# Altium schematic sheet 09.SchDoc
size 297 x 209 mm
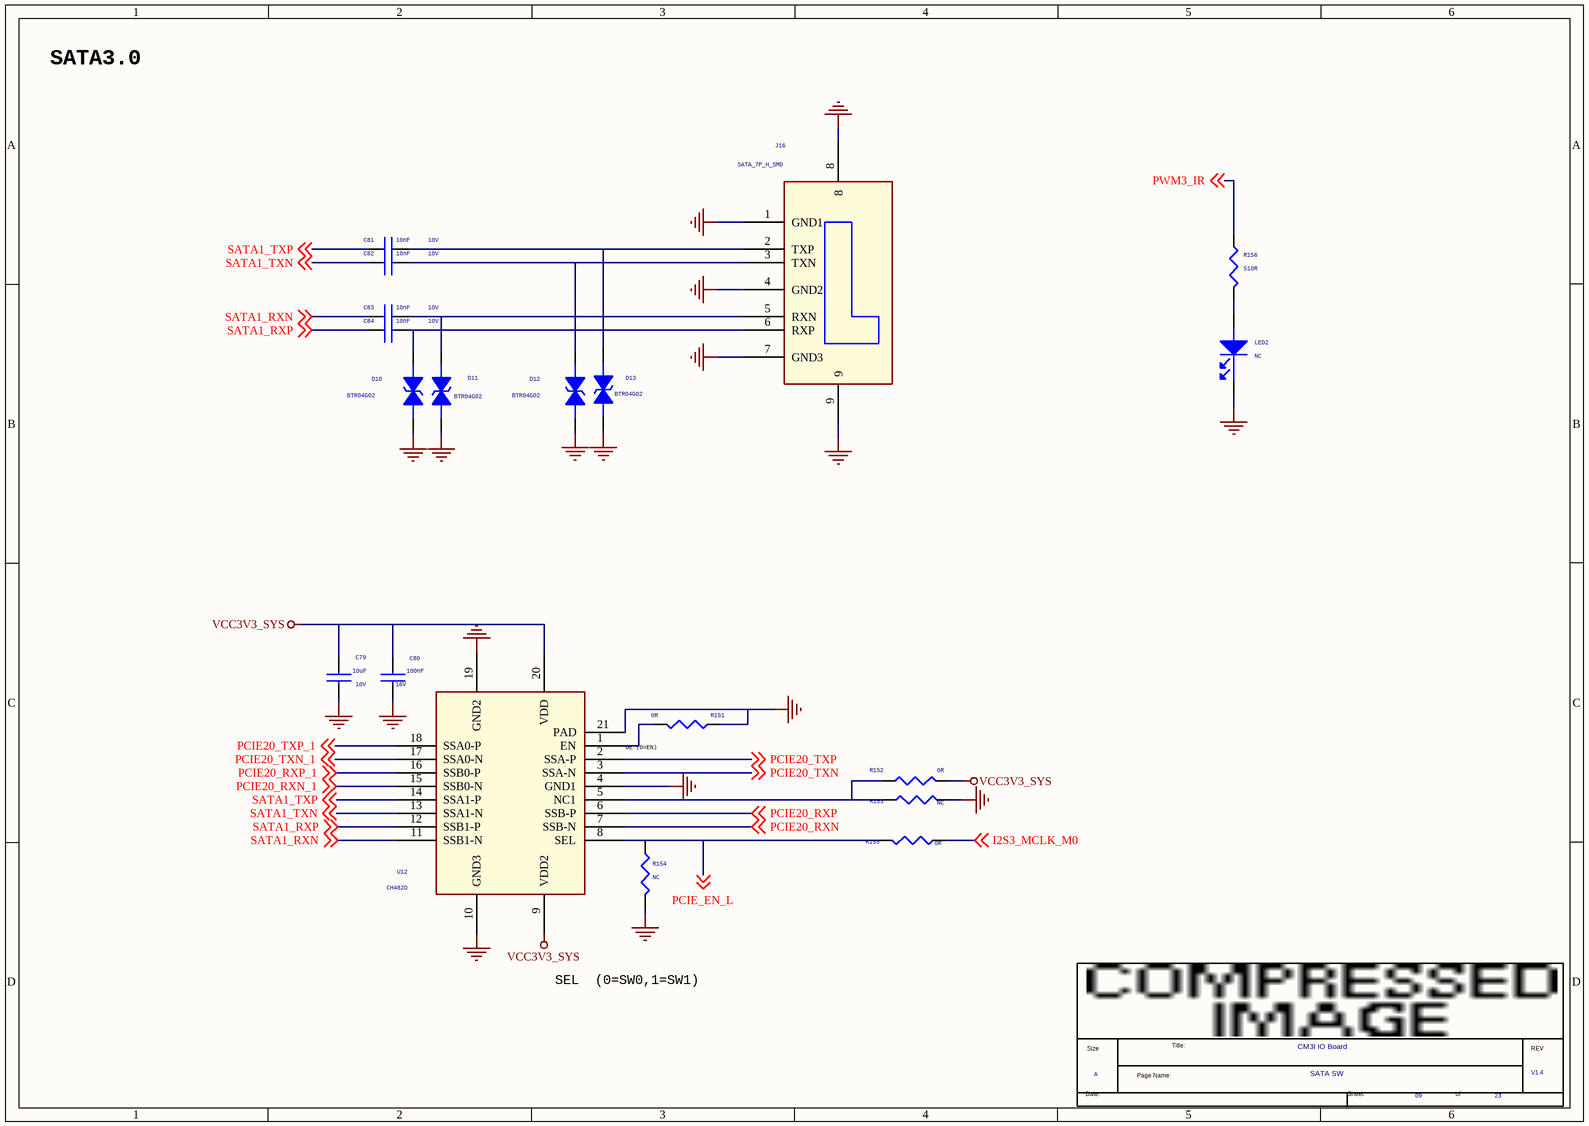
[diagram p0: 09.SchDoc]

## Parts
*  Page Count: 23  Page Number: 09  Page Size: A  Title: CM3I IO Board  RevCode: V1.4  Doc: SATA SW  (hidden comment: radxa_1010)  (graphical)
C79  10uF  Voltage: 10V  [C0603]
C80  100nF  Voltage: 16V  [C0402]
C81  10nF  Voltage: 10V  [C0402]
C82  10nF  Voltage: 10V  [C0402]
C83  10nF  Voltage: 10V  [C0402]
C84  10nF  Voltage: 10V  [C0402]
D10  BTR04G02  [ESD0402_1xD5]
D11  BTR04G02  [ESD0402_1xD5]
D12  BTR04G02  [ESD0402_1xD5]
D13  BTR04G02  [ESD0402_1xD5]
J16  SATA_7P_H_SMD  [SMD_SATA_7P_50_180]
LED2  NC  [LED0603]
R151  0R  [R0402]
R152  0R  [R0402]
R153  NC  [R0402]
R154  NC  [R0402]
R155  0R  [R0402]
R156  510R  [R0402]
U12  CH482D  [CH482X]

## Nets
GND: C79.2 C80.2 D10.1 D11.1 D12.1 D13.1 J16.1(GND1) J16.4(GND2) J16.7(GND3) J16.8 J16.9 LED2.2(CATHODE) R151.1 R153.1 R154.2 U12.4(GND1) U12.10(GND3) U12.19(GND2) U12.21(PAD)
VCC3V3_SYS: C79.1 C80.1 R152.1 U12.9(VDD2) U12.20(VDD)
I2S3_MCLK_M0: R155.2 ; off-sheet I2S3_MCLK_M0
PCIE20_RXN: U12.7(SSB-N) ; off-sheet PCIE20_RXN
PCIE20_RXN_1: U12.15(SSB0-N) ; off-sheet PCIE20_RXN_1
PCIE20_RXP: U12.6(SSB-P) ; off-sheet PCIE20_RXP
PCIE20_RXP_1: U12.16(SSB0-P) ; off-sheet PCIE20_RXP_1
PCIE20_TXN: U12.3(SSA-N) ; off-sheet PCIE20_TXN
PCIE20_TXN_1: U12.17(SSA0-N) ; off-sheet PCIE20_TXN_1
PCIE20_TXP: U12.2(SSA-P) ; off-sheet PCIE20_TXP
PCIE20_TXP_1: U12.18(SSA0-P) ; off-sheet PCIE20_TXP_1
PCIE_EN_L: R154.1 R155.1 U12.8(SEL) ; off-sheet PCIE_EN_L
PWM3_IR: R156.1 ; off-sheet PWM3_IR
SATA1_RXN: C83.1 U12.11(SSB1-N) ; off-sheet SATA1_RXN
SATA1_RXP: C84.1 U12.12(SSB1-P) ; off-sheet SATA1_RXP
SATA1_TXN: C82.1 U12.13(SSA1-N) ; off-sheet SATA1_TXN
SATA1_TXP: C81.1 U12.14(SSA1-P) ; off-sheet SATA1_TXP
NetC81_2: C81.2 D13.2 J16.2(TXP)
NetC82_2: C82.2 D12.2 J16.3(TXN)
NetC83_2: C83.2 D11.2 J16.5(RXN)
NetC84_2: C84.2 D10.2 J16.6(RXP)
NetLED2_1: LED2.1(ANODE) R156.2
NetR151_2: R151.2 U12.1(EN)
NetR152_2: R152.2 R153.2 U12.5(NC1)

## Notes on the sheet
- SATA3.0
- OE (0=EN)
- SEL  (0=SW0,1=SW1)
- (in symbol radxa_1010) Size; Title:; REV; Page Name:; Date:; Sheet; of

## Library data of the parts
C79 = CAP NP_0: cap,22.00uF,+/-10%,10V,X5R,C0805; Manufacturer: TDK; RK PN: C2012X5R1A226K125AB; Priority: A; Tolerance: 10%; Dielectric: X5R; Part Type: C0805; Manufacturer PN: C2012X5R1A226K125AB; Created by: JJJ
C80 = CAP NP_0: cap,100.00nF,+/-10%,16V,X5R,C0402; Manufacturer PN: C1005X5R1C104K050BA; Manufacturer: TDK; Tolerance: 10%; Priority: A; Dielectric: X5R; Created by: JJJ; Part Type: C0402; RK PN: C1005X5R1C104K050BA
C81-C84 = CAP NP_0: cap,10.00nF,+/-10%,10V,X7R,C0201; Manufacturer PN: C0603X7R1A103K030BA; Manufacturer: TDK; Tolerance: 10%; Priority: A; Dielectric: X7R; Created by: JJJ; Part Type: C0201; RK PN: C0603X7R1A103K030BA
D10 = DIODE BI_DIR TRIG_0: 1-Line, Bi-directional, Transient Voltage Suppressors.17.5pF.; Manufacturer PN: ESD5451N; Manufacturer: WillSemi(韦尔半导体); OPTION: DNP; Priority: A; Created by: JJJ; Part Type: ESD_TVS; RK PN: ESD5451N
D11-D13 = DIODE BI_DIR TRIG_0: 1-Line, Bi-directional, Transient Voltage Suppressors.17.5pF.; Manufacturer: WillSemi(韦尔半导体); RK PN: ESD5451N; Priority: A; OPTION: DNP; Part Type: ESD_TVS; Manufacturer PN: ESD5451N; Created by: JJJ
J16 = SATA_DIP_1
LED2 = LED: 贴片LED灯，0603，红色; option: SATA2_ACT_LED; RK PN: LED_RED; Priority: A; Part Type: LED; Created by: JJJ
R151 R152 = RESISTOR_0_Dup1: 通用厚膜电阻,0R,+/-5%,R0402,1/16W.; Manufacturer PN: RC0402JR-070RL; Manufacturer: YAGEO; Tolerance: 5%; Wattage: 1/16W; Priority: A; Created by: YTL; Part Type: 通用厚膜电阻; RK PN: RC0402JR-070RL
R153 = RESISTOR_0_Dup1: 通用厚膜电阻,0R,+/-5%,R0402,1/16W.; Manufacturer: YAGEO; Tolerance: 5%; RK PN: RC0402JR-070RL; Priority: A; Wattage: 1/16W; Part Type: 通用厚膜电阻; Manufacturer PN: RC0402JR-070RL; Created by: YTL
R154 = RESISTOR_0_Dup1: 通用厚膜电阻,4K7,+/-5%,R0402,1/16W.; Manufacturer PN: RC0402JR-074K7L; Manufacturer: YAGEO; Tolerance: 5%; Wattage: 1/16W; Priority: A; Created by: YTL; Part Type: 通用厚膜电阻; RK PN: RC0402JR-074K7L
R155 = RESISTOR_0_Dup1: 通用厚膜电阻,100R,+/-5%,R0402,1/16W.; Manufacturer PN: RC0402JR-07100RL; Manufacturer: YAGEO; Tolerance: 5%; Wattage: 1/16W; Priority: A; Created by: YTL; Part Type: 通用厚膜电阻; RK PN: RC0402JR-07100RL
R156 = RESISTOR_0_Dup1: 通用厚膜电阻,510R,+/-5%,R0402,1/16W.; Manufacturer PN: RC0402JR-07510RL; Manufacturer: YAGEO; Tolerance: 5%; Wattage: 1/16W; Priority: A; Created by: YTL; Part Type: 通用厚膜电阻; RK PN: RC0402JR-07510RL
U12 = CH482X
* = radxa_1010: Page Create Date: March  8, 1995